# Altium schematic sheet WT2_MCU.SchDoc
size A4
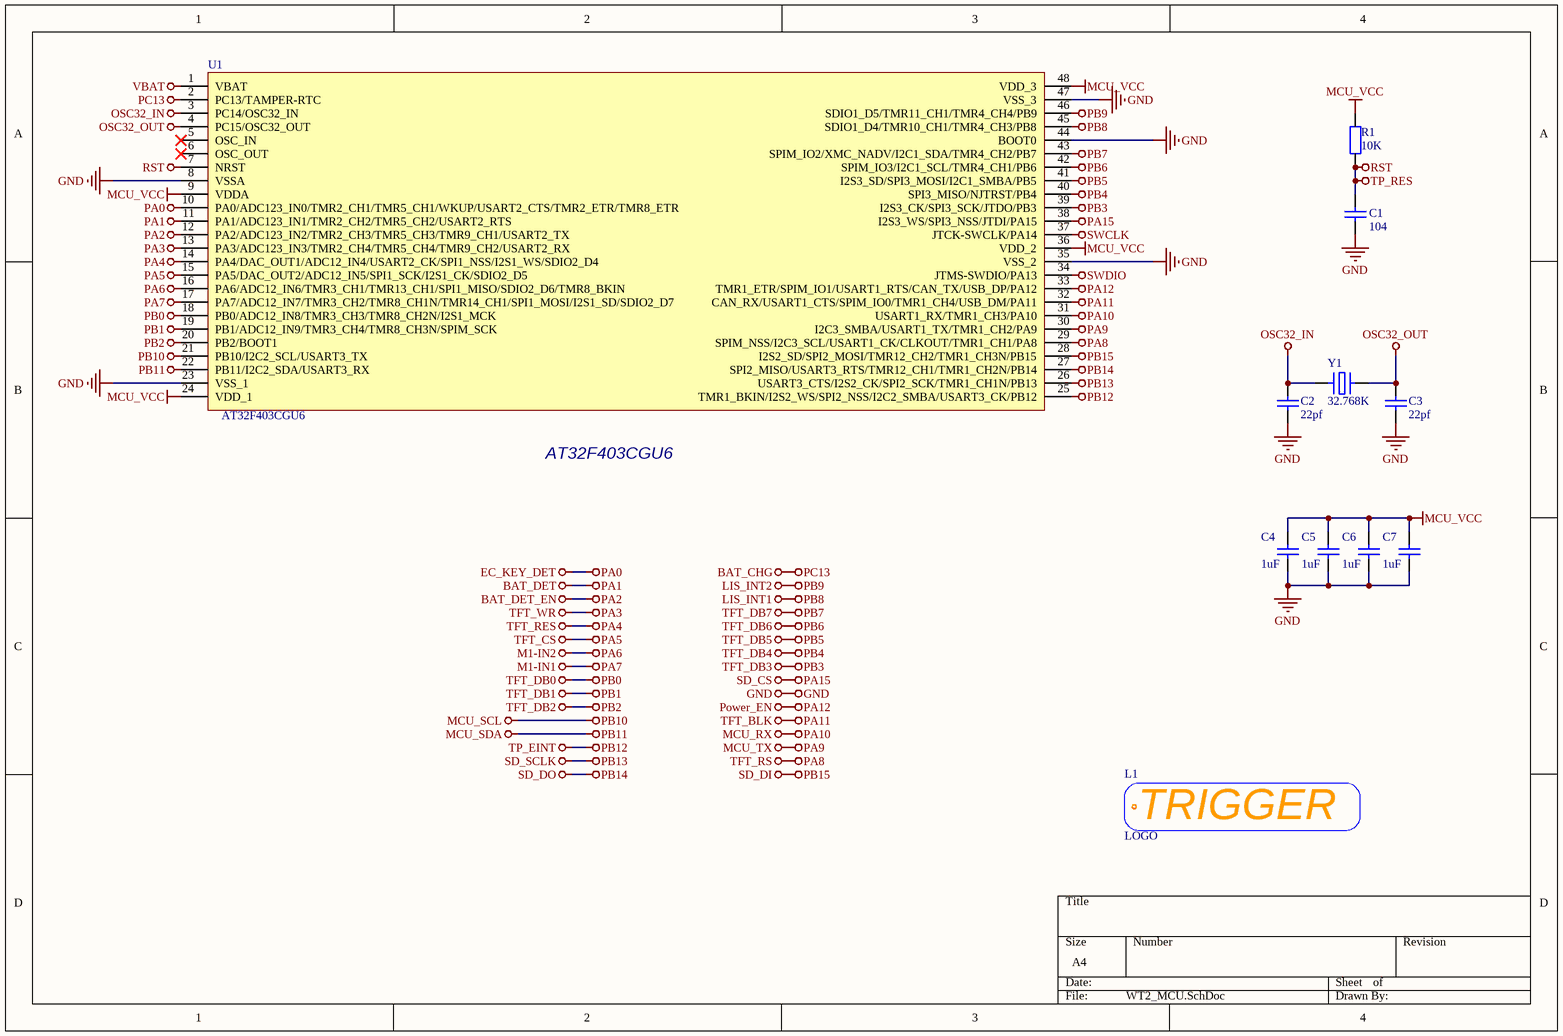
[diagram p0: WT2_MCU.SchDoc]

## Parts
C1  104  [电容_C0402]
C2  22pf  [电容_C0402]
C3  22pf  [电容_C0402]
C4  1uF  [电容_C0402]
C5  1uF  [电容_C0402]
C6  1uF  [电容_C0402]
C7  1uF  [电容_C0402]
L1  LOGO  [LOGO REV L BS]
R1  10K  [电阻_R0402]
U1  AT32F403CGU6  [AT主控_QFN48(6X6)]
Y1  32.768K  [晶振_3215]

## Nets
BAT_CHG: U1.2(PC13/TAMPER-RTC)  [also labelled PC13]
BAT_DET: U1.11(PA1/ADC123_IN1/TMR2_CH2/TMR5_CH2/USART2_RTS)  [also labelled PA1]
BAT_DET_EN: U1.12(PA2/ADC123_IN2/TMR2_CH3/TMR5_CH3/TMR9_CH1/USART2_TX)  [also labelled PA2]
EC_KEY_DET: U1.10(PA0/ADC123_IN0/TMR2_CH1/TMR5_CH1/WKUP/USART2_CTS/TMR2_ETR/TMR8_ETR)  [also labelled PA0]
GND: C1.1 C2.2 C3.2 C4.1 C5.1 C6.1 C7.1 U1.0(VSS) U1.8(VSSA) U1.23(VSS_1) U1.35(VSS_2) U1.44(BOOT0) U1.47(VSS_3)
LIS_INT1: U1.45(SDIO1_D4/TMR10_CH1/TMR4_CH3/PB8)  [also labelled PB8]
LIS_INT2: U1.46(SDIO1_D5/TMR11_CH1/TMR4_CH4/PB9)  [also labelled PB9]
M1-IN1: U1.17(PA7/ADC12_IN7/TMR3_CH2/TMR8_CH1N/TMR14_CH1/SPI1_MOSI/I2S1_SD/SDIO2_D7)  [also labelled PA7]
M1-IN2: U1.16(PA6/ADC12_IN6/TMR3_CH1/TMR13_CH1/SPI1_MISO/SDIO2_D6/TMR8_BKIN)  [also labelled PA6]
MCU_RX: U1.31(USART1_RX/TMR1_CH3/PA10)  [also labelled PA10]
MCU_SCL: U1.21(PB10/I2C2_SCL/USART3_TX)  [also labelled PB10]
MCU_SDA: U1.22(PB11/I2C2_SDA/USART3_RX)  [also labelled PB11]
MCU_TX: U1.30(I2C3_SMBA/USART1_TX/TMR1_CH2/PA9)  [also labelled PA9]
MCU_VCC: C4.2 C5.2 C6.2 C7.2 R1.2 U1.9(VDDA) U1.24(VDD_1) U1.36(VDD_2) U1.48(VDD_3)
OSC32_IN: C2.1 U1.3(PC14/OSC32_IN) Y1.1
OSC32_OUT: C3.1 U1.4(PC15/OSC32_OUT) Y1.2
PA3: U1.13(PA3/ADC123_IN3/TMR2_CH4/TMR5_CH4/TMR9_CH2/USART2_RX)  [also labelled TFT_WR]
PA4: U1.14(PA4/DAC_OUT1/ADC12_IN4/USART2_CK/SPI1_NSS/I2S1_WS/SDIO2_D4)  [also labelled TFT_RES]
PA5: U1.15(PA5/DAC_OUT2/ADC12_IN5/SPI1_SCK/I2S1_CK/SDIO2_D5)  [also labelled TFT_CS]
PA8: U1.29(SPIM_NSS/I2C3_SCL/USART1_CK/CLKOUT/TMR1_CH1/PA8)  [also labelled TFT_RS]
PA11: U1.32(CAN_RX/USART1_CTS/SPIM_IO0/TMR1_CH4/USB_DM/PA11)  [also labelled TFT_BLK]
PA12: U1.33(TMR1_ETR/SPIM_IO1/USART1_RTS/CAN_TX/USB_DP/PA12)  [also labelled Power_EN]
PA15: U1.38(I2S3_WS/SPI3_NSS/JTDI/PA15)  [also labelled SD_CS]
PB0: U1.18(PB0/ADC12_IN8/TMR3_CH3/TMR8_CH2N/I2S1_MCK)  [also labelled TFT_DB0]
PB1: U1.19(PB1/ADC12_IN9/TMR3_CH4/TMR8_CH3N/SPIM_SCK)  [also labelled TFT_DB1]
PB2: U1.20(PB2/BOOT1)  [also labelled TFT_DB2]
PB3: U1.39(I2S3_CK/SPI3_SCK/JTDO/PB3)  [also labelled TFT_DB3]
PB4: U1.40(SPI3_MISO/NJTRST/PB4)  [also labelled TFT_DB4]
PB5: U1.41(I2S3_SD/SPI3_MOSI/I2C1_SMBA/PB5)  [also labelled TFT_DB5]
PB6: U1.42(SPIM_IO3/I2C1_SCL/TMR4_CH1/PB6)  [also labelled TFT_DB6]
PB7: U1.43(SPIM_IO2/XMC_NADV/I2C1_SDA/TMR4_CH2/PB7)  [also labelled TFT_DB7]
PB12: U1.25(TMR1_BKIN/I2S2_WS/SPI2_NSS/I2C2_SMBA/USART3_CK/PB12)  [also labelled TP_EINT]
PB13: U1.26(USART3_CTS/I2S2_CK/SPI2_SCK/TMR1_CH1N/PB13)  [also labelled SD_SCLK]
PB14: U1.27(SPI2_MISO/USART3_RTS/TMR12_CH1/TMR1_CH2N/PB14)  [also labelled SD_DO]
PB15: U1.28(I2S2_SD/SPI2_MOSI/TMR12_CH2/TMR1_CH3N/PB15)  [also labelled SD_DI]
RST: C1.2 R1.1 U1.7(NRST)  [also labelled TP_RES]
SWCLK: U1.37(JTCK-SWCLK/PA14)
SWDIO: U1.34(JTMS-SWDIO/PA13)
VBAT: U1.1(VBAT)

Not connected (* = marked no-connect by the designer): U1 5(OSC_IN)* 6(OSC_OUT)*

## Notes on the sheet
- (near U1) AT32F403CGU6
- (in symbol LOGO_TRIGGER) TRIGGER

## Library data of the parts
C1-C7 = cap: U: 50V; 参数: Cap,0805,X7R,104K,50V,125C,±10%
  C1: C: 104
  C2 C3: C: 22pf
  C4-C7: C: 1uF
L1 = LOGO_TRIGGER
R1 = Res: P: 1/8W; 参数: Res,0805,0R,±1%,1/8W,100ppm,155C; R: 10K
U1 = AT32F403CGU6: _Footprint: QFN48; _Comma: ,; _Name: MCU; _Specification: MCU,AT32F403CGU6,QFN48; _Model: AT32F403CGU6
Y1 = XTAL_A: _Name: CRYSTALS; _Comma: ,; _Specification: CRYSTALS,32.768K,*,10ppm,12pF; _Accuracy: 10ppm; _CL: 12pF; _Footprint: *; _Frequency: 32.768K